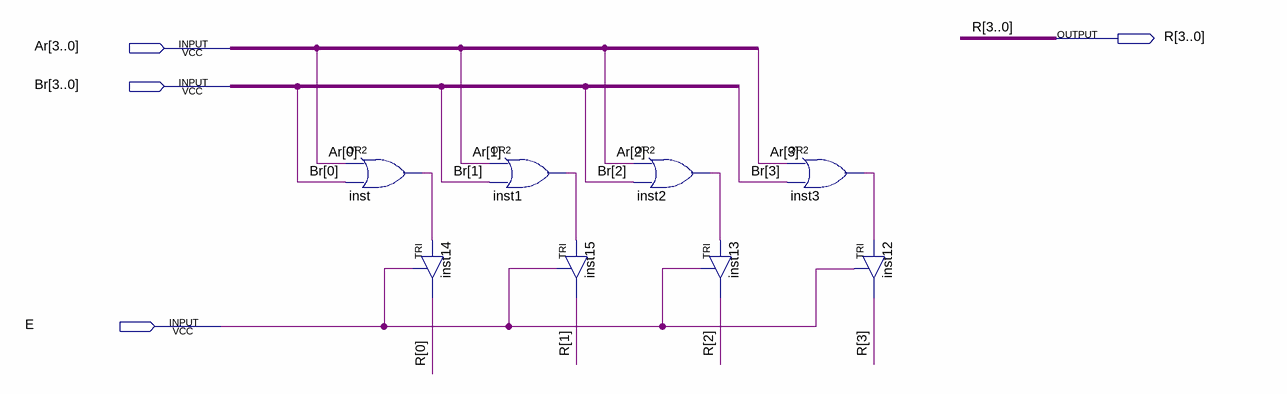
[diagram p0: schematic sheet]
// Quartus schematic Or4bits.bdf as structural Verilog: 8 symbols, 4 pins
module Or4bits (
  input  [3:0] Ar,
  input  [3:0] Br,
  input  E,
  output [3:0] R
);

  wire inst1_out, inst2_out, inst3_out, inst_out;

  or inst (inst_out, Ar[0], Br[0]);
  TRI inst14 (.IN(inst_out), .OE(E), .OUT(R[0]));
  or inst1 (inst1_out, Ar[1], Br[1]);
  TRI inst15 (.IN(inst1_out), .OE(E), .OUT(R[1]));
  or inst2 (inst2_out, Ar[2], Br[2]);
  TRI inst13 (.IN(inst2_out), .OE(E), .OUT(R[2]));
  or inst3 (inst3_out, Ar[3], Br[3]);
  TRI inst12 (.IN(inst3_out), .OE(E), .OUT(R[3]));
endmodule
